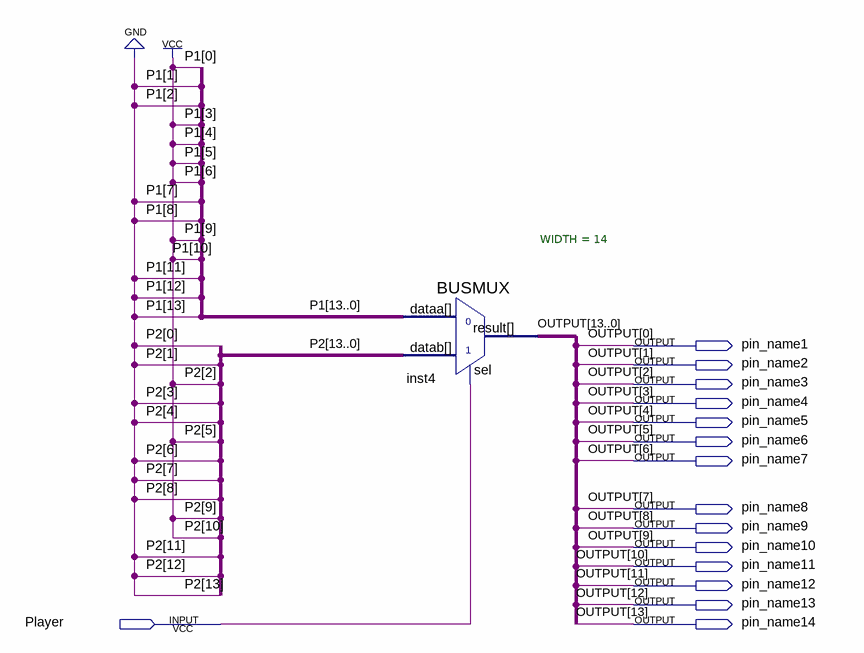
[diagram p0: schematic sheet]
// Quartus schematic player_indicator.bdf as structural Verilog: 1 symbols, 15 pins
module player_indicator (
  input  Player,
  output pin_name1,
  output pin_name2,
  output pin_name3,
  output pin_name4,
  output pin_name5,
  output pin_name6,
  output pin_name7,
  output pin_name8,
  output pin_name9,
  output pin_name10,
  output pin_name11,
  output pin_name12,
  output pin_name13,
  output pin_name14
);

  BUSMUX #(.WIDTH(14)) inst4 (
    .datab(14'b00011000100100), .sel(Player), .dataa(14'b00011001111001),
    .result({pin_name14, pin_name13, pin_name12, pin_name11, pin_name10, pin_name9, pin_name8, pin_name7, pin_name6, pin_name5, pin_name4, pin_name3, pin_name2, pin_name1}));

  // Other names for the same wires on the sheet: OUTPUT[13:0] = {pin_name14, pin_name13, pin_name12, pin_name11, pin_name10, pin_name9, pin_name8, pin_name7, pin_name6, pin_name5, pin_name4, pin_name3, pin_name2, pin_name1}
endmodule
